# Altium project PCB_Project.PrjPcb
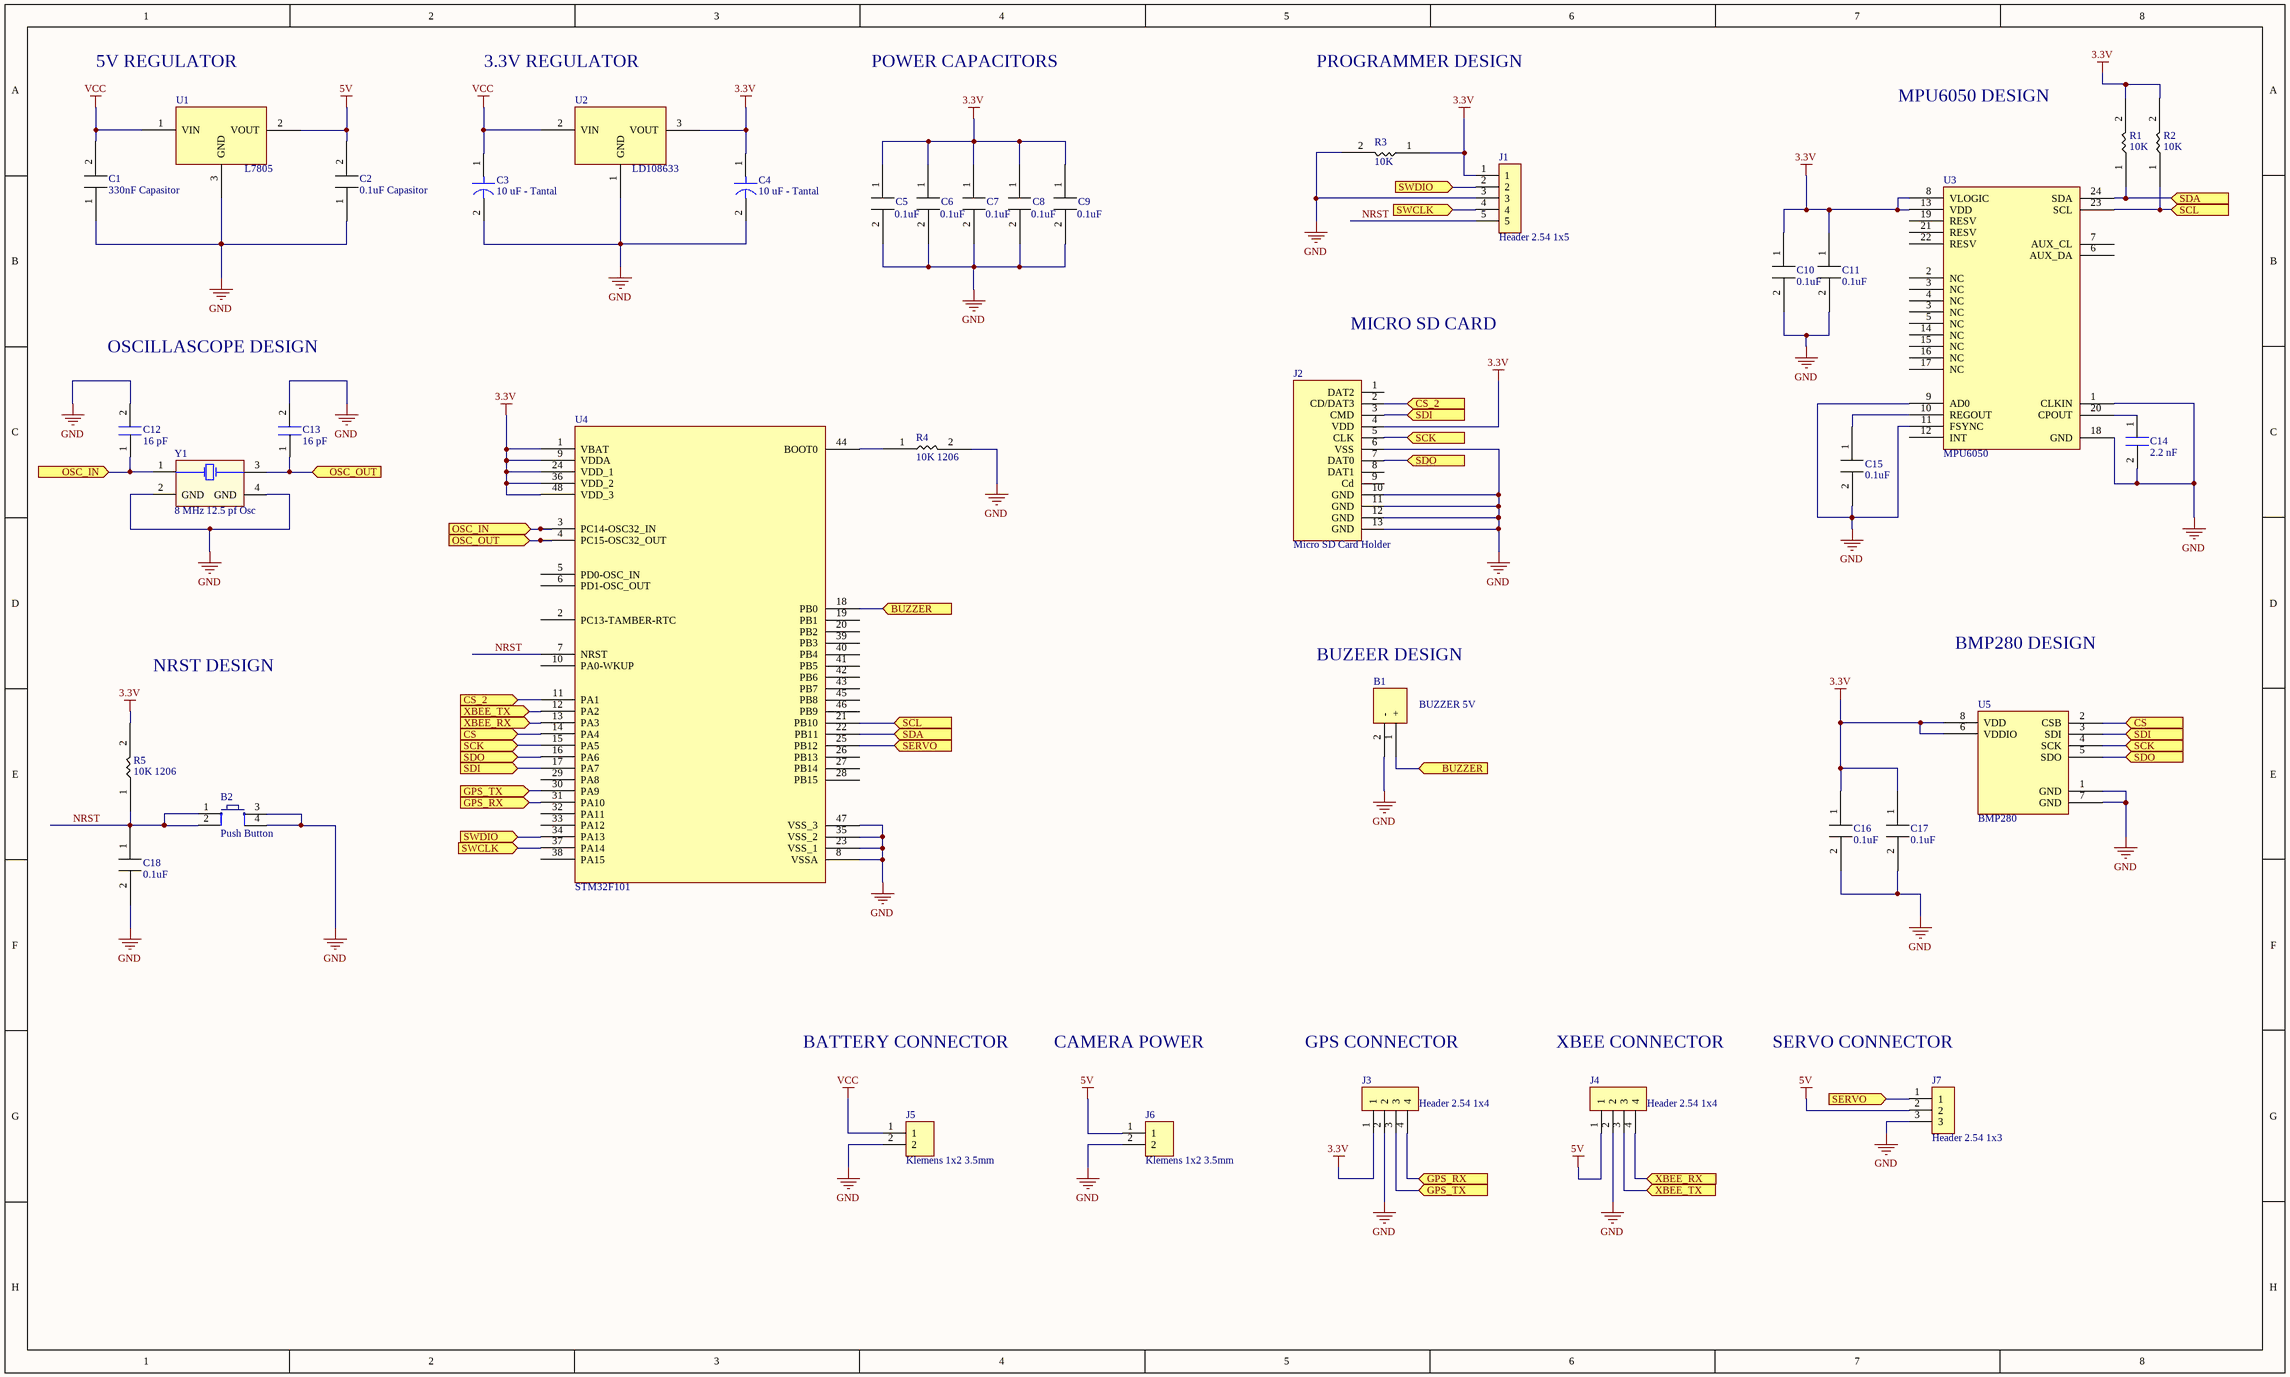
[diagram p0: UDEMY_Sheet.SchDoc]
1 sheet, 38 parts. Net scope: flat (ports and power ports of the same name join across sheets).
Board file: UDEMY_PCB.PcbDoc

## Sheet UDEMY_Sheet.SchDoc
size 508 x 304 mm; SheetNumber: 1; SheetTotal: 1

### Parts
B1  BUZZER 5V  [BUZZER 5V]
B2  Push Button  [PUSB BUTTON-SMD]
C1  330nF Capasitor  [CAP 1206]
C2  0.1uF Capasitor  [CAP 1206]
C3  10 uF - Tantal  [C1206- TANTAL]
C4  10 uF - Tantal  [C1206- TANTAL]
C5  0.1uF  [CAP 1206]
C6  0.1uF  [CAP 1206]
C7  0.1uF  [CAP 1206]
C8  0.1uF  [CAP 1206]
C9  0.1uF  [CAP 1206]
C10  0.1uF  [CAP 1206]
C11  0.1uF  [CAP 1206]
C12  16 pF  [CAP 1206]
C13  16 pF  [CAP 1206]
C14  2.2 nF  [CAP 1206]
C15  0.1uF  [CAP 1206]
C16  0.1uF  [CAP 1206]
C17  0.1uF  [CAP 1206]
C18  0.1uF  [CAP 1206]
J1  Header 2.54 1x5  [Header 2.54 1x5]
J2  Micro SD Card Holder  [Micro SD Card Holder]
J3  Header 2.54 1x4  [Header 2.54 1x4]
J4  Header 2.54 1x4  [Header 2.54 1x4]
J5  Klemens 1x2 3.5mm  [Klemens 1x2 - 3.5mm]
J6  Klemens 1x2 3.5mm  [Klemens 1x2 - 3.5mm]
J7  Header 2.54 1x3  [Header 2.54 1x3]
R1  10K  [1206 RES]
R2  10K  [1206 RES]
R3  10K  [1206 RES]
R4  10K 1206  [1206 RES]
R5  10K 1206  [1206 RES]
U1  L7805  [DPAK228P972X230-3N]
U2  LD108633  [DPAK228P972X230-3N]
U3  MPU6050  [QFN50P400X400X90_HS-25N]
U4  STM32F101  [LQFP48-STM]
U5  BMP280  [BMP280]
Y1  8 MHz 12.5 pf Osc  [8 MHZ Osc.]

### Ports
BUZZER (in, see UDEMY_Sheet[4D]), BUZZER (in, see UDEMY_Sheet[5E]), CS (in, see UDEMY_Sheet[2E]), CS (in, see UDEMY_Sheet[8E]), CS_2 (in, see UDEMY_Sheet[2E]), CS_2 (in, see UDEMY_Sheet[5C]), GPS_RX (in, see UDEMY_Sheet[2E]), GPS_RX (in, see UDEMY_Sheet[5G]), GPS_TX (in, see UDEMY_Sheet[2E]), GPS_TX (in, see UDEMY_Sheet[5G]), OSC_IN (in, see UDEMY_Sheet[1C]), OSC_IN (in, see UDEMY_Sheet[2D]), OSC_OUT (in, see UDEMY_Sheet[2C]), OSC_OUT (in, see UDEMY_Sheet[2D]), SCK (in, see UDEMY_Sheet[2E], UDEMY_Sheet[5C]), SCK (in, see UDEMY_Sheet[2E], UDEMY_Sheet[8E]), SCK (in, see UDEMY_Sheet[5C], UDEMY_Sheet[8E]), SCL (in, see UDEMY_Sheet[4E]), SCL (in, see UDEMY_Sheet[8B]), SDA (in, see UDEMY_Sheet[4E]), SDA (in, see UDEMY_Sheet[8B]), SDI (in, see UDEMY_Sheet[2E], UDEMY_Sheet[5C]), SDI (in, see UDEMY_Sheet[2E], UDEMY_Sheet[8E]), SDI (in, see UDEMY_Sheet[5C], UDEMY_Sheet[8E]), SDO (in, see UDEMY_Sheet[2E], UDEMY_Sheet[5C]), SDO (in, see UDEMY_Sheet[2E], UDEMY_Sheet[8E]), SDO (in, see UDEMY_Sheet[5C], UDEMY_Sheet[8E]), SERVO (in, see UDEMY_Sheet[4E]), SERVO (in, see UDEMY_Sheet[7G]), SWCLK (in, see UDEMY_Sheet[2E]), SWCLK (in, see UDEMY_Sheet[5B]), SWDIO (in, see UDEMY_Sheet[2E]), SWDIO (in, see UDEMY_Sheet[5B]), XBEE_RX (in, see UDEMY_Sheet[2E]), XBEE_RX (in, see UDEMY_Sheet[6G]), XBEE_TX (in, see UDEMY_Sheet[2E]), XBEE_TX (in, see UDEMY_Sheet[6G])

### Nets
3.3V: C4.1 C5.1 C6.1 C7.1 C8.1 C9.1 C10.1 C11.1 C16.1 C17.1 J1.1 J2.4(VDD) J3.1 R1.2 R2.2 R3.1 R5.2 U2.3(VOUT) U3.8(VLOGIC) U3.13(VDD) U4.1(VBAT) U4.9(VDDA) U4.24(VDD_1) U4.36(VDD_2) U4.48(VDD_3) U5.6(VDDIO) U5.8(VDD)
5V: C2.2 J4.1 J6.1 J7.2 U1.2(VOUT)
GND: B1.2(-) B2.3 B2.4 C1.1 C2.1 C3.2 C4.2 C5.2 C6.2 C7.2 C8.2 C9.2 C10.2 C11.2 C12.2 C13.2 C14.2 C15.2 C16.2 C17.2 C18.2 J1.3 J2.6(VSS) J2.10(GND) J2.11(GND) J2.12(GND) J2.13(GND) J3.2 J4.2 J5.2 J6.2 J7.3 R3.2 R4.2 U1.3(GND) U2.1(GND) U3.1(CLKIN) U3.9(AD0) U3.11(FSYNC) U3.18(GND) U4.8(VSSA) U4.23(VSS_1) U4.35(VSS_2) U4.47(VSS_3) U5.1(GND) U5.7(GND) Y1.2(GND) Y1.4(GND)
VCC: C1.2 C3.1 J5.1 U1.1(VIN) U2.2(VIN)
NRST: B2.1 B2.2 C18.1 J1.5 R5.1 U4.7(NRST)
NetB1_1: B1.1(+) U4.18(PB0) ; port BUZZER
NetC12_1: C12.1 U4.3(PC14-OSC32_IN) Y1.1 ; port OSC_IN
NetC13_1: C13.1 U4.4(PC15-OSC32_OUT) Y1.3 ; port OSC_OUT
NetC14_1: C14.1 U3.20(CPOUT)
NetC15_1: C15.1 U3.10(REGOUT)
NetJ1_2: J1.2 U4.34(PA13) ; port SWDIO
NetJ1_4: J1.4 U4.37(PA14) ; port SWCLK
NetJ2_2: J2.2(CD/DAT3) U4.11(PA1) ; port CS_2
NetJ2_3: J2.3(CMD) U4.17(PA7) U5.3(SDI) ; port SDI
NetJ2_5: J2.5(CLK) U4.15(PA5) U5.4(SCK) ; port SCK
NetJ2_7: J2.7(DAT0) U4.16(PA6) U5.5(SDO) ; port SDO
NetJ3_3: J3.3 U4.30(PA9) ; port GPS_TX
NetJ3_4: J3.4 U4.31(PA10) ; port GPS_RX
NetJ4_3: J4.3 U4.12(PA2) ; port XBEE_TX
NetJ4_4: J4.4 U4.13(PA3) ; port XBEE_RX
NetJ7_1: J7.1 U4.25(PB12) ; port SERVO
NetR1_1: R1.1 U3.24(SDA) U4.22(PB11) ; port SDA
NetR2_1: R2.1 U3.23(SCL) U4.21(PB10) ; port SCL
NetR4_1: R4.1 U4.44(BOOT0)
NetU4_14: U4.14(PA4) U5.2(CSB) ; port CS

Not connected (* = marked no-connect by the designer): J2 1(DAT2) 8(DAT1) 9(Cd); U3 2(NC) 3(NC) 4(NC) 5(NC) 6(AUX_DA) 7(AUX_CL) 12(INT) 14(NC) 15(NC) 16(NC) 17(NC) 19(RESV) 21(RESV) 22(RESV); U4 2(PC13-TAMBER-RTC) 5(PD0-OSC_IN) 6(PD1-OSC_OUT) 10(PA0-WKUP) 19(PB1) 20(PB2) 26(PB13) 27(PB14) 28(PB15) 29(PA8) 32(PA11) 33(PA12) 38(PA15) 39(PB3) 40(PB4) 41(PB5) 42(PB6) 43(PB7) 45(PB8) 46(PB9)

### Notes on the sheet
- 5V REGULATOR
- 3.3V REGULATOR
- POWER CAPACITORS
- PROGRAMMER DESIGN
- MPU6050 DESIGN
- OSCILLASCOPE DESIGN
- MICRO SD CARD
- BMP280 DESIGN
- NRST DESIGN
- BUZEER DESIGN
- BATTERY CONNECTOR
- CAMERA POWER
- GPS CONNECTOR
- XBEE CONNECTOR
- SERVO CONNECTOR

### Library data of the parts
B2 = Push Button: Smd Push Button; Satın Alma Linki: https://urun.n11.com/diger/mini-pushbutton-switch-smd-P227461537?gclid=Cj0KCQjwkoDmBRCcARIsAG3xzl8Y_-jeD7HocNM6lvuZ_rVp83568XPGtNzlPwXWLph8oCRqo0yh87UaApZYEALw_wcB&gclsrc=aw.ds
C5-C11 C15-C18 = 0.1uF Capasitor
C14 = 2.2 nF c1206
R1-R3 = 10K 1206
U1 = L7805: L7805 5V REGULATOR DPAK
U2 = LD108633: LD108633 3.3V REGULATOR DPAK
U3 = MPU6050: MPU6050 GYRO
U4 = STM32F101: STM32F101 48 pinli mikrodenetleyicisi
U5 = BMP280: BMP280 SENSOR